# Altium schematic sheet LPC1768_2.SchDoc: LPC1768
size 298 x 212 mm; Date: 31.05.2016 15:06:26; SheetNumber: 3
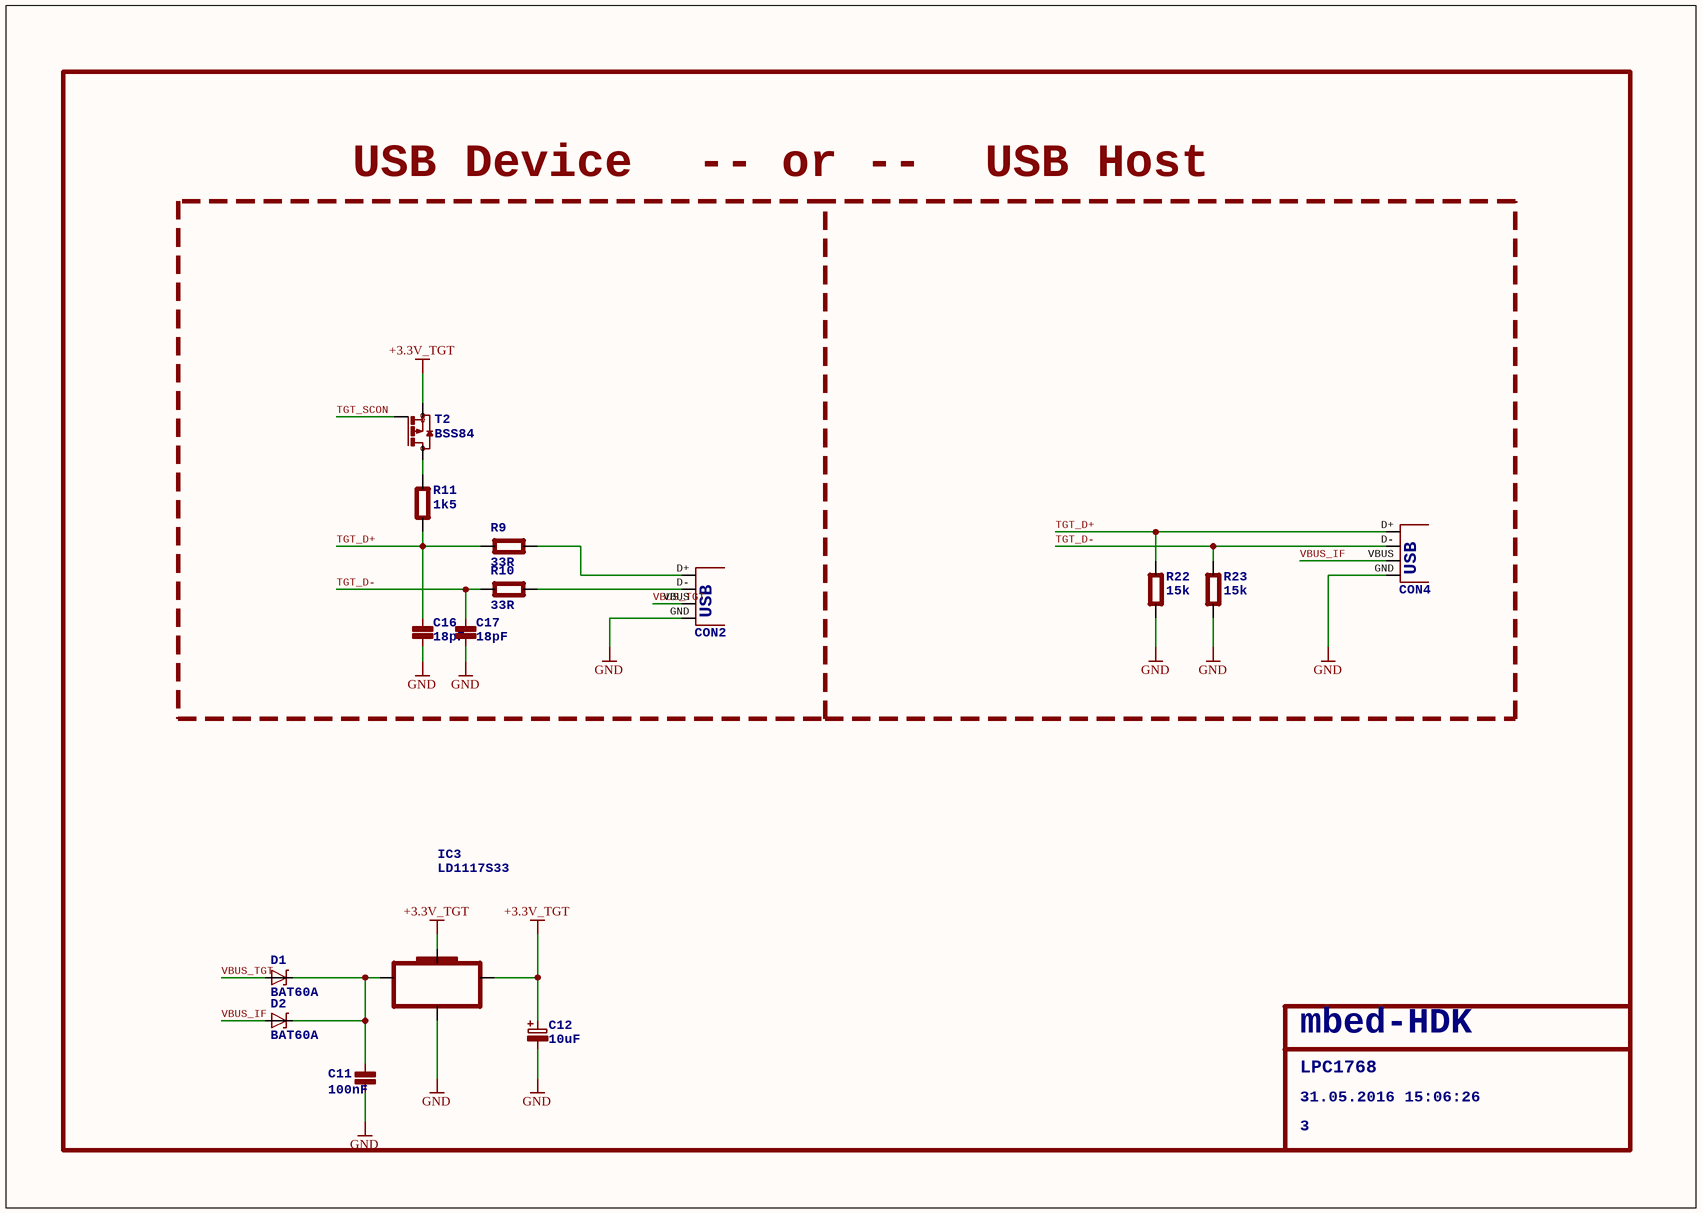
[diagram p0: LPC1768_2.SchDoc]

## Parts
C11  100nF  [0603]
C12  10uF  [CASE-B]
C16  18pF  [0603]
C17  18pF  [0603]
CON2  USB-MB-S  [USB-MB-S]  (value not drawn)
CON4  USB-A-H  [USB-A-H]  (value not drawn)
D1  BAT60A  [BAT60A]
D2  BAT60A  [BAT60A]
IC3  LD1117S33  [SOT223]
R9  33R  [0603]
R10  33R  [0603]
R11  1k5  [0603]
R22  15k  [0603]
R23  15k  [0603]
T2  BSS84  [SOT23]

## Nets
+3.3V_TGT: C12.1 IC3.2(OUT) IC3.4(K) T2.2(S)
GND: C11.2(P$2) C12.2 C16.2(P$2) C17.2(P$2) CON2.GND CON4.GND IC3.1(GND) R22.1(P$1) R23.1(P$1)
TGT_D+: C16.1(P$1) CON4.D+ R9.1(P$1) R11.2(P$2) R22.2(P$2)
TGT_D-: C17.1(P$1) CON4.D- R10.1(P$1) R23.2(P$2)
TGT_SCON: T2.1(G)
VBUS_IF: CON4.VBUS D2.A
VBUS_TGT: CON2.VBUS D1.A
NetC11_1: C11.1(P$1) D1.K D2.K IC3.3(IN)
NetCON2_D+: CON2.D+ R9.2(P$2)
NetCON2_D-: CON2.D- R10.2(P$2)
NetR11_1: R11.1(P$1) T2.3(D)

## Notes on the sheet
- USB Device
- -- or --
- USB Host
- LPC1768
- mbed-HDK
- 31.05.2016 15:06:26
- 3

## Library data of the parts
C11 C16 C17 = C0603
C12 = C-POLB
CON2 = USB-MB-S: USB Connectors; USB: USB
CON4 = USB-A-H: USB Connectors; USB: USB
IC3 = LD1117S33: VOLTAGE REGULATOR SMD 3,3V
R9-R11 R22 R23 = R0603
T2 = BSS84: P-CHANNEL MOS FET